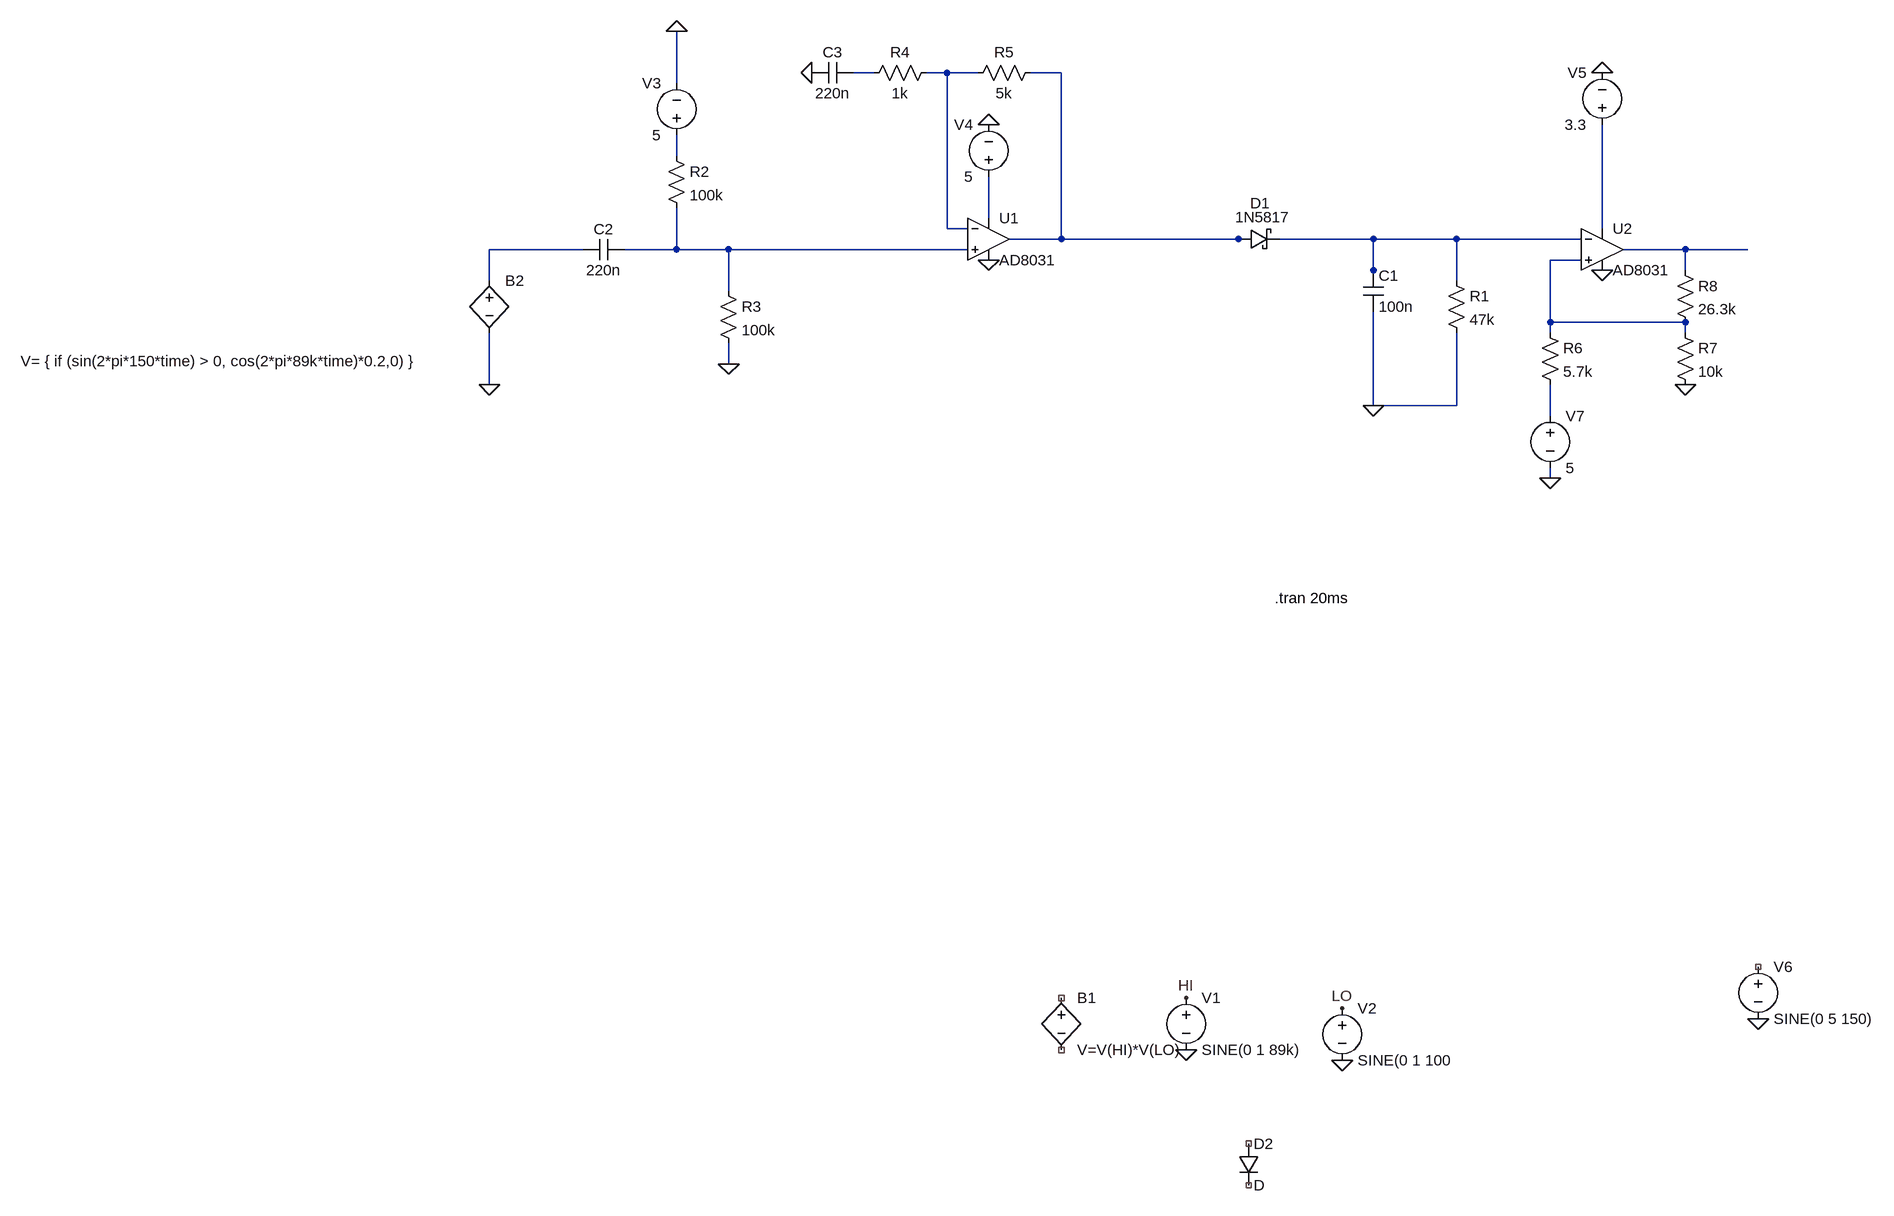
[diagram p0: schematic RadioDetector.asc]
RadioDetector.asc, the LTspice schematic file:
Version 4
SHEET 1 2068 820
WIRE 224 -1008 192 -1008
WIRE 336 -1008 304 -1008
WIRE 384 -1008 336 -1008
WIRE 512 -1008 464 -1008
WIRE -80 -992 -80 -1072
WIRE -80 -880 -80 -912
WIRE 400 -784 400 -848
WIRE 336 -768 336 -1008
WIRE 368 -768 336 -768
WIRE 1344 -768 1344 -928
WIRE 512 -752 512 -1008
WIRE 512 -752 432 -752
WIRE 784 -752 512 -752
WIRE 800 -752 784 -752
WIRE 992 -752 848 -752
WIRE 1120 -752 992 -752
WIRE 1312 -752 1120 -752
WIRE -224 -736 -368 -736
WIRE -80 -736 -80 -800
WIRE -80 -736 -160 -736
WIRE 0 -736 -80 -736
WIRE 368 -736 0 -736
WIRE 1472 -736 1376 -736
WIRE 1568 -736 1472 -736
WIRE 1312 -720 1264 -720
WIRE 992 -704 992 -752
WIRE 1472 -704 1472 -736
WIRE -368 -688 -368 -736
WIRE 992 -688 992 -704
WIRE 1120 -688 1120 -752
WIRE 0 -672 0 -736
WIRE 1264 -624 1264 -720
WIRE 1472 -624 1264 -624
WIRE 1264 -608 1264 -624
WIRE 1472 -608 1472 -624
WIRE 0 -560 0 -592
WIRE -368 -528 -368 -608
WIRE 992 -496 992 -640
WIRE 1120 -496 1120 -608
WIRE 1120 -496 992 -496
WIRE 1264 -480 1264 -528
WIRE 1264 -384 1264 -400
FLAG 704 496 0
FLAG 704 416 HI
FLAG 944 432 LO
FLAG 944 512 0
FLAG 1584 448 0
FLAG -368 -528 0
FLAG 0 -560 0
FLAG -80 -1072 0
FLAG 992 -496 0
FLAG 400 -928 0
FLAG 128 -1008 0
FLAG 400 -720 0
FLAG 1472 -528 0
FLAG 1264 -384 0
FLAG 1344 -1008 0
FLAG 1344 -704 0
SYMBOL voltage 704 400 R0
WINDOW 123 0 0 Left 0
WINDOW 39 0 0 Left 0
SYMATTR InstName V1
SYMATTR Value SINE(0 1 89k)
SYMBOL voltage 944 416 R0
WINDOW 123 0 0 Left 0
WINDOW 39 0 0 Left 0
SYMATTR InstName V2
SYMATTR Value SINE(0 1 100
SYMBOL bv 512 400 R0
SYMATTR InstName B1
SYMATTR Value V=V(HI)*V(LO)
SYMBOL schottky 784 -736 R270
WINDOW 0 56 34 VTop 2
WINDOW 3 34 38 VTop 2
SYMATTR InstName D1
SYMATTR Value 1N5817
SYMATTR Description Diode
SYMATTR Type diode
SYMBOL cap 976 -704 R0
SYMATTR InstName C1
SYMATTR Value 100n
SYMBOL res 1104 -704 R0
SYMATTR InstName R1
SYMATTR Value 47k
SYMBOL diode 784 640 R0
SYMATTR InstName D2
SYMBOL voltage 1584 352 R0
WINDOW 123 24 124 Left 2
WINDOW 39 0 0 Left 0
SYMATTR InstName V6
SYMATTR Value SINE(0 5 150)
SYMBOL bv -368 -704 R0
WINDOW 3 -721 140 Left 2
SYMATTR InstName B2
SYMATTR Value V= { if (sin(2*pi*150*time) > 0, cos(2*pi*89k*time)*0.2,0) }
SYMBOL cap -160 -752 R90
WINDOW 0 0 32 VBottom 2
WINDOW 3 32 32 VTop 2
SYMATTR InstName C2
SYMATTR Value 220n
SYMBOL voltage -80 -896 R180
WINDOW 0 24 96 Left 2
WINDOW 3 24 16 Left 2
SYMATTR InstName V3
SYMATTR Value 5
SYMBOL res -96 -896 R0
SYMATTR InstName R2
SYMATTR Value 100k
SYMBOL res -16 -688 R0
SYMATTR InstName R3
SYMATTR Value 100k
SYMBOL OpAmps\\AD8031 400 -816 R0
SYMATTR InstName U1
SYMBOL voltage 400 -832 R180
WINDOW 0 24 96 Left 2
WINDOW 3 24 16 Left 2
SYMATTR InstName V4
SYMATTR Value 5
SYMBOL res 320 -1024 R90
WINDOW 0 0 56 VBottom 2
WINDOW 3 32 56 VTop 2
SYMATTR InstName R4
SYMATTR Value 1k
SYMBOL res 480 -1024 R90
WINDOW 0 0 56 VBottom 2
WINDOW 3 32 56 VTop 2
SYMATTR InstName R5
SYMATTR Value 5k
SYMBOL cap 192 -1024 R90
WINDOW 0 0 32 VBottom 2
WINDOW 3 32 32 VTop 2
SYMATTR InstName C3
SYMATTR Value 220n
SYMBOL OpAmps\\AD8031 1344 -800 R0
SYMATTR InstName U2
SYMBOL voltage 1344 -912 R180
WINDOW 0 24 96 Left 2
WINDOW 3 24 16 Left 2
SYMATTR InstName V5
SYMATTR Value 3.3
SYMBOL res 1248 -624 R0
SYMATTR InstName R6
SYMATTR Value 5.7k
SYMBOL res 1456 -624 R0
SYMATTR InstName R7
SYMATTR Value 10k
SYMBOL res 1456 -720 R0
SYMATTR InstName R8
SYMATTR Value 26.3k
SYMBOL voltage 1264 -496 R0
SYMATTR InstName V7
SYMATTR Value 5
TEXT 840 -200 Left 2 !.tran 20ms

The netlist it stands for:
* RadioDetector.asc
V1 HI 0 SINE(0 1 89k)
V2 LO 0 SINE(0 1 100
B1 NC_01 NC_02 V=V(HI)*V(LO)
D1 N003 N007 1N5817
C1 N007 0 100n
R1 N007 0 47k
D2 NC_03 NC_04 D
V6 NC_05 0 SINE(0 5 150)
B2 N008 0 V= { if (sin(2*pi*150*time) > 0, cos(2*pi*89k*time)*0.2,0) }
C2 N009 N008 220n
V3 N004 0 5
R2 N004 N009 100k
R3 N009 0 100k
XU1 N009 N002 N005 0 N003 AD8031  ; pins In+ In- V+ V- OUT
V4 N005 0 5
R4 N002 N001 1k
R5 N003 N002 5k
C3 N001 0 220n
XU2 N011 N007 N006 0 N010 AD8031  ; pins In+ In- V+ V- OUT
V5 N006 0 3.3
R6 N011 N012 5.7k
R7 N011 0 10k
R8 N010 N011 26.3k
V7 N012 0 5
.model D D
.lib standard.dio
.tran 20ms
.backanno
.end